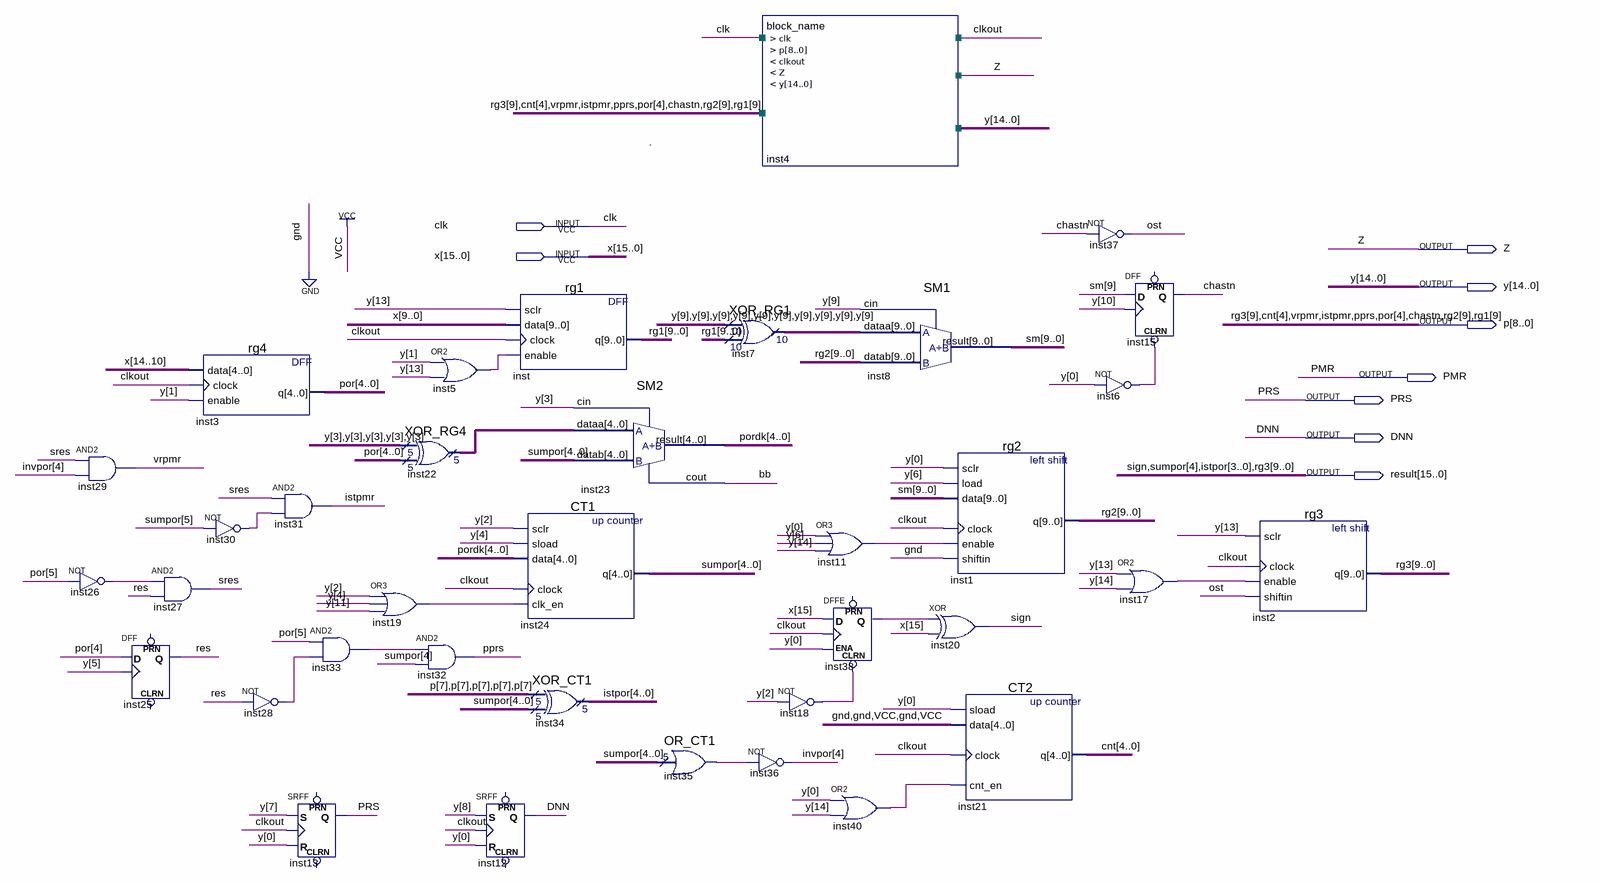
[diagram p0: schematic sheet]
// Quartus schematic Delenie.bdf as structural Verilog: 36 symbols, 9 pins
module Delenie (
  input  clk,
  input  [15:0] x,
  output Z,
  output [14:0] y,
  output [8:0] p,
  output PMR,
  output PRS,
  output DNN,
  output [15:0] result
);

  wire bb, clkout, inst5_out, inst6_out, inst11_out, inst17_out, inst18_out, inst19_out, inst26_out,
       inst28_out, inst30_out, inst33_out, inst35_result, inst38_q, inst40_out, ost, res, sres;
  wire [3:0] cnt;
  wire [4:0] inst22_result, pordk;
  wire [4:4] invpor, istpor;
  wire [5:0] por, sumpor;
  wire [8:0] rg1, rg2;
  wire [9:0] inst7_result, sm;

  and inst29 (p[6], sres, invpor[4]);
  not inst26 (inst26_out, por[5]);
  DFF inst25 (.CLK(y[5]), .D(p[3]), .Q(res));  // open: CLRN, PRN
  rg4 inst3 (.data(x[14:10]), .clock(clkout), .enable(y[1]), .q({p[3], por[3:0]}));
  and inst27 (sres, inst26_out, res);
  not inst30 (inst30_out, sumpor[5]);
  not inst28 (inst28_out, res);
  and inst31 (p[5], sres, inst30_out);
  and inst33 (inst33_out, por[5], inst28_out);
  SRFF inst13 (.S(y[7]), .R(y[0]), .CLK(clkout), .Q(PRS));  // open: PRN, CLRN
  or inst19 (inst19_out, y[2], y[4], y[11]);
  or inst5 (inst5_out, y[1], y[13]);
  XOR_RG4 inst22 (.data0x({5{y[3]}}), .data1x({p[3], por[3:0]}), .result(inst22_result));
  and inst32 (p[4], inst33_out, result[14]);
  SRFF inst12 (.S(y[8]), .R(y[0]), .CLK(clkout), .Q(DNN));  // open: PRN, CLRN
  rg1 inst (.sclr(y[13]), .data(x[9:0]), .clock(clkout), .enable(inst5_out), .q({p[0], rg1}));
  CT1 inst24 (
    .sclr(y[2]), .sload(y[4]), .data(pordk), .clock(clkout), .clk_en(inst19_out),
    .q({result[14], sumpor[3:0]}));
  XOR_CT1 inst34 (.data0x({5{p[7]}}), .data1x({result[14], sumpor[3:0]}), .result({istpor[4], result[13:10]}));
  SM2 inst23 (.dataa(inst22_result), .datab({result[14], sumpor[3:0]}), .cin(y[3]), .result(pordk), .cout(bb));
  OR_CT1 inst35 (.data({result[14], sumpor[3:0]}), .result(inst35_result));
  XOR_RG1 inst7 (.data0x({10{y[9]}}), .data1x({p[0], rg1}), .result(inst7_result));
  block_name inst4 (.clk(clk), .clkout(clkout), .Z(Z), .y(y));  // open: p
  not inst18 (inst18_out, y[2]);
  not inst36 (invpor[4], inst35_result);
  SM1 inst8 (.dataa(inst7_result), .datab({p[1], rg2}), .cin(y[9]), .result(sm));
  or inst11 (inst11_out, y[0], y[6], y[14]);
  DFFE inst38 (.CLRN(inst18_out), .D(x[15]), .CLK(clkout), .ENA(y[0]), .Q(inst38_q));  // open: PRN
  or inst40 (inst40_out, y[0], y[14]);
  rg2 inst1 (.sclr(y[0]), .load(y[6]), .data(sm), .clock(clkout), .enable(inst11_out), .shiftin(1'b0), .q({p[1], rg2}));
  xor inst20 (result[15], inst38_q, x[15]);
  CT2 inst21 (.sload(y[0]), .data(5'b00101), .clock(clkout), .cnt_en(inst40_out), .q({p[7], cnt}));
  not inst37 (ost, p[2]);
  not inst6 (inst6_out, y[0]);
  DFF inst15 (.CLRN(inst6_out), .CLK(y[10]), .D(sm[9]), .Q(p[2]));  // open: PRN
  or inst17 (inst17_out, y[13], y[14]);
  rg3 inst2 (.sclr(y[13]), .clock(clkout), .enable(inst17_out), .shiftin(ost), .q({p[8], result[8:0]}));

  assign result[9] = p[8];

  // Other names for the same wires on the sheet: chastn = p[2]; cnt[4] = p[7]; istpmr = p[5];
  //   istpor[3:0] = result[13:10]; por[4] = p[3]; pprs = p[4]; rg1[9] = p[0]; rg2[9] = p[1];
  //   rg3[9:0] = {p[8], result[8:0]}; sign = result[15]; sumpor[4] = result[14]; vrpmr = p[6]

  // Notes on the sheet:
  //   .
endmodule
